# EAGLE design PAM2401_Module (EAGLE 9.6.2)
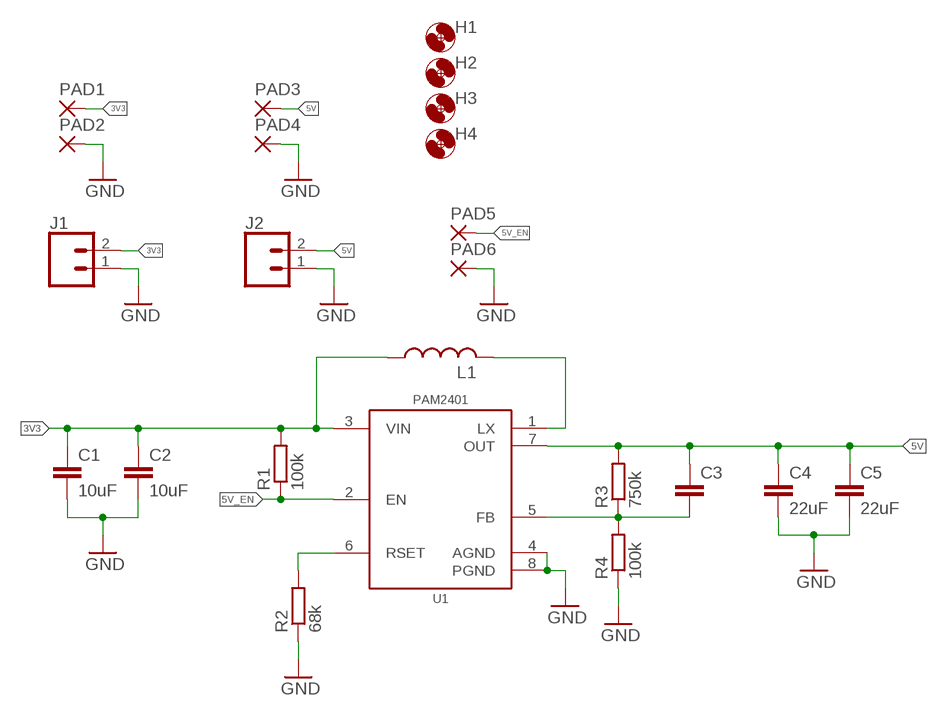
[diagram p0: schematic, sheet 1]

## Parts
C1  10uF  C-EU10UFC0805  [C0805]
C2  10uF  C-EU10UFC0805  [C0805]
C3  C-EUC0603  [C0603]
C4  22uF  C-EU22UFC0805  [C0805]
C5  22uF  C-EU22UFC0805  [C0805]
H1  MOUNTING_HOLE2_NP  [2_56]
H2  MOUNTING_HOLE2_NP  [2_56]
H3  MOUNTING_HOLE2_NP  [2_56]
H4  MOUNTING_HOLE2_NP  [2_56]
J1  CONN_023.5MM_ROUND_RESTRICT  [SCREWTERMINAL-3.5MM-2_ROUND_RESTRICT]
J2  CONN_023.5MM_ROUND_RESTRICT  [SCREWTERMINAL-3.5MM-2_ROUND_RESTRICT]
L1  INDUCTOR_MAPI_2.5X2  [WE-MAPI(2.5X2)]
PAD1  SMD5  [SMD2,54-5,08]
PAD2  SMD5  [SMD2,54-5,08]
PAD3  SMD5  [SMD2,54-5,08]
PAD4  SMD5  [SMD2,54-5,08]
PAD5  SMD2  [SMD1,27-2,54]
PAD6  SMD2  [SMD1,27-2,54]
R1  100k  R-EU_100KR0603  [R0603]
R2  68k  R-EU_R0603  [R0603]
R3  750k  R-EU_750KR0603  [R0603]
R4  100k  R-EU_100KR0603  [R0603]
U1  PAM2401MSOP  [MSOP_8]

## Nets
3V3: C1.1 C2.1 J1.2 L1.P$1 PAD1.1(P) R1.2 U1.3(VIN)
5V: C3.1 C4.1 C5.1 J2.2 PAD3.1(P) R3.2 U1.7(OUT)
5V_EN: PAD5.1(P) R1.1 U1.2(EN)
GND: C1.2 C2.2 C4.2 C5.2 J1.1 J2.1 PAD2.1(P) PAD4.1(P) PAD6.1(P) R2.1 R4.1 U1.4(AGND) U1.8(PGND)
N$2: R2.2 U1.6(RSET)
N$3: C3.2 R3.1 R4.2 U1.5(FB)
N$18: L1.P$2 U1.1(LX)

## Library data of the parts
C1 C2 = bschulz_passives:C-EU: CAPACITOR, European symbol; DIGIKEY: 490-6473-1-ND; MF: Murata; MPN: GRM21BR61C106KE15K
C3 = bschulz_passives:C-EU: CAPACITOR, European symbol
C4 C5 = bschulz_passives:C-EU: CAPACITOR, European symbol; DIGIKEY: 490-9952-1-ND; MF: Murata; MPN: GRM219R61C226ME15L
H1-H4 = bschulz:MOUNTING_HOLE: Genaric Mechanical Mounting Hole Hole diameter based on max body diameter + 15% Keepout ring is for diameter of socket cap screw (minimum required clearance) TPlace ring is for diameter of pan head screw (recomended clearance) Specifications: Socket Cap <http://fastener-express.com/fastener-technical/SocketscapSS-Alloy.pdf> Button Head Socket Cap <http://fastener-express.com/fastener-technical/Button-Socket-alloy.pdf> Pan Head <http://fastener-express.com/fastener-technical/pan-machine-Screws.pdf>; DIGIKEY: DNP; MF: N/A; MPN: DNP
J1 J2 = bschulz:CONN_02: Genaric 2 terminal header SCREW_2.54 <https://www.digikey.com/product-detail/en/on-shore-technology-inc/OSTVN02A150/ED10561-ND/1588862> 39532_RA <https://www.digikey.com/product-detail/en/molex/0395321002/WM7845-ND/1280696>; DIGIKEY: ED2635-ND; MF: On Shore; MPN: OSTTE020161
L1 = bschulz:INDUCTOR: Genaric Inductor
PAD1-PAD4 = wirepad:SMD5: SMD PAD
PAD5 PAD6 = bschulz:SMD2: SMD PAD; DIGIKEY: N/A; MF: N/A; MPN: DNP
R1 R4 = bschulz_passives:R-EU_: RESISTOR, European symbol Digikey Parts: Yageo, 0402 <https://www.digikey.com/products/en/resistors/chip-resistor-surface-mount/52?k=&pkeyword=&sv=0&s=4356&sf=1&FV=-1%7C13%2C7%7C2%2C1291%7C39157%2C1989%7C0%2C-8%7C52%2C3%7C1131%2C3%7C2503&quantity=&ColumnSort=0&page=1&stock=1&pageSize=25> Yageo, 0603 <https://www.digikey.com/products/en/resistors/chip-resistor-surface-mount/52?k=&pkeyword=&sv=0&pv1291=39245&sf=1&FV=-5%7C4356%2C-5%7C47360%2C-8%7C52%2C-1%7C13%2C7%7C2%2C1989%7C0&quantity=10&ColumnSort=1000011&page=1&stock=1&pageSize=25> Panasonic, 0603 <https://www.digikey.com/products/en/resistors/chip-resistor-surface-mount/52?k=&pkeyword=&pv252=68&sf=0&FV=ffec373d%2C1c0002%2C142c040c%2C1f140000%2Cffe00034%2C80002%2Cc0001&quantity=&ColumnSort=0&page=1&stock=1&pageSize=25> Panasonic, precision, 0603 <https://www.digikey.com/products/en/resistors/chip-resistor-surface-mount/52?FV=ffec4907%2Cfffc000a%2Cc0172%2C142c040c%2C1f140000%2Cffe00034%2C1c0002&quantity=100&ColumnSort=2085&page=1&stock=1&pageSize=25> Panasonic, 0805 <https://www.digikey.com/products/en/resistors/chip-resistor-surface-mount/52?k=&pkeyword=&pv3=1&sf=0&FV=ffec373d%2C1c0002%2C1f140000%2Cffe00034%2C142c040d&quantity=&ColumnSort=0&page=1&stock=1&pageSize=25> Rohm, current sense <https://www.digikey.com/products/en/resistors/chip-resistor-surface-mount/52?k=&pkeyword=&pv3=1&sf=0&FV=ffecb688%2C1f140000%2Cffe00034%2C1c0002&quantity=&ColumnSort=0&page=1&stock=1&pageSize=25> Vishay, pulse proof automotive <https://www.digikey.com/products/en/resistors/chip-resistor-surface-mount/52?k=&pkeyword=&pv7=2&sf=0&FV=ffec5d6b%2Cffe00034%2C1f140000&quantity=&ColumnSort=0&page=1&stock=1&pageSize=25>; DIGIKEY: 311-100KHRCT-ND; MF: Yageo; MPN: RC0603FR-07100KL; VALUE_PART: 100k
R2 = bschulz_passives:R-EU_: RESISTOR, European symbol Digikey Parts: Yageo, 0402 <https://www.digikey.com/products/en/resistors/chip-resistor-surface-mount/52?k=&pkeyword=&sv=0&s=4356&sf=1&FV=-1%7C13%2C7%7C2%2C1291%7C39157%2C1989%7C0%2C-8%7C52%2C3%7C1131%2C3%7C2503&quantity=&ColumnSort=0&page=1&stock=1&pageSize=25> Yageo, 0603 <https://www.digikey.com/products/en/resistors/chip-resistor-surface-mount/52?k=&pkeyword=&sv=0&pv1291=39245&sf=1&FV=-5%7C4356%2C-5%7C47360%2C-8%7C52%2C-1%7C13%2C7%7C2%2C1989%7C0&quantity=10&ColumnSort=1000011&page=1&stock=1&pageSize=25> Panasonic, 0603 <https://www.digikey.com/products/en/resistors/chip-resistor-surface-mount/52?k=&pkeyword=&pv252=68&sf=0&FV=ffec373d%2C1c0002%2C142c040c%2C1f140000%2Cffe00034%2C80002%2Cc0001&quantity=&ColumnSort=0&page=1&stock=1&pageSize=25> Panasonic, precision, 0603 <https://www.digikey.com/products/en/resistors/chip-resistor-surface-mount/52?FV=ffec4907%2Cfffc000a%2Cc0172%2C142c040c%2C1f140000%2Cffe00034%2C1c0002&quantity=100&ColumnSort=2085&page=1&stock=1&pageSize=25> Panasonic, 0805 <https://www.digikey.com/products/en/resistors/chip-resistor-surface-mount/52?k=&pkeyword=&pv3=1&sf=0&FV=ffec373d%2C1c0002%2C1f140000%2Cffe00034%2C142c040d&quantity=&ColumnSort=0&page=1&stock=1&pageSize=25> Rohm, current sense <https://www.digikey.com/products/en/resistors/chip-resistor-surface-mount/52?k=&pkeyword=&pv3=1&sf=0&FV=ffecb688%2C1f140000%2Cffe00034%2C1c0002&quantity=&ColumnSort=0&page=1&stock=1&pageSize=25> Vishay, pulse proof automotive <https://www.digikey.com/products/en/resistors/chip-resistor-surface-mount/52?k=&pkeyword=&pv7=2&sf=0&FV=ffec5d6b%2Cffe00034%2C1f140000&quantity=&ColumnSort=0&page=1&stock=1&pageSize=25>; MF: Yageo
R3 = bschulz_passives:R-EU_: RESISTOR, European symbol Digikey Parts: Yageo, 0402 <https://www.digikey.com/products/en/resistors/chip-resistor-surface-mount/52?k=&pkeyword=&sv=0&s=4356&sf=1&FV=-1%7C13%2C7%7C2%2C1291%7C39157%2C1989%7C0%2C-8%7C52%2C3%7C1131%2C3%7C2503&quantity=&ColumnSort=0&page=1&stock=1&pageSize=25> Yageo, 0603 <https://www.digikey.com/products/en/resistors/chip-resistor-surface-mount/52?k=&pkeyword=&sv=0&pv1291=39245&sf=1&FV=-5%7C4356%2C-5%7C47360%2C-8%7C52%2C-1%7C13%2C7%7C2%2C1989%7C0&quantity=10&ColumnSort=1000011&page=1&stock=1&pageSize=25> Panasonic, 0603 <https://www.digikey.com/products/en/resistors/chip-resistor-surface-mount/52?k=&pkeyword=&pv252=68&sf=0&FV=ffec373d%2C1c0002%2C142c040c%2C1f140000%2Cffe00034%2C80002%2Cc0001&quantity=&ColumnSort=0&page=1&stock=1&pageSize=25> Panasonic, precision, 0603 <https://www.digikey.com/products/en/resistors/chip-resistor-surface-mount/52?FV=ffec4907%2Cfffc000a%2Cc0172%2C142c040c%2C1f140000%2Cffe00034%2C1c0002&quantity=100&ColumnSort=2085&page=1&stock=1&pageSize=25> Panasonic, 0805 <https://www.digikey.com/products/en/resistors/chip-resistor-surface-mount/52?k=&pkeyword=&pv3=1&sf=0&FV=ffec373d%2C1c0002%2C1f140000%2Cffe00034%2C142c040d&quantity=&ColumnSort=0&page=1&stock=1&pageSize=25> Rohm, current sense <https://www.digikey.com/products/en/resistors/chip-resistor-surface-mount/52?k=&pkeyword=&pv3=1&sf=0&FV=ffecb688%2C1f140000%2Cffe00034%2C1c0002&quantity=&ColumnSort=0&page=1&stock=1&pageSize=25> Vishay, pulse proof automotive <https://www.digikey.com/products/en/resistors/chip-resistor-surface-mount/52?k=&pkeyword=&pv7=2&sf=0&FV=ffec5d6b%2Cffe00034%2C1f140000&quantity=&ColumnSort=0&page=1&stock=1&pageSize=25>; DIGIKEY: 311-750KHRCT-ND; MF: Yageo; MPN: RC0603FR-07750KL; VALUE_PART: 750k
U1 = bschulz:PAM2401: PAM2401 - Step-Up (Boost) DC-DC Converter Characteristics: Vin: 0.9V ~ 4.75V Vout: 2.5V ~ 5V Iout: 1A IQ: 150μA Operating Temperature: -40°C to 85°C Digikey: PAM2401SCADJDICT-ND <https://www.digikey.com/en/products/detail/diodes-incorporated/PAM2401SCADJ/4898817>; DIGIKEY: PAM2401SCADJDICT-ND; MF: Diodes Inc; MPN: PAM2401SCADJ

## Board
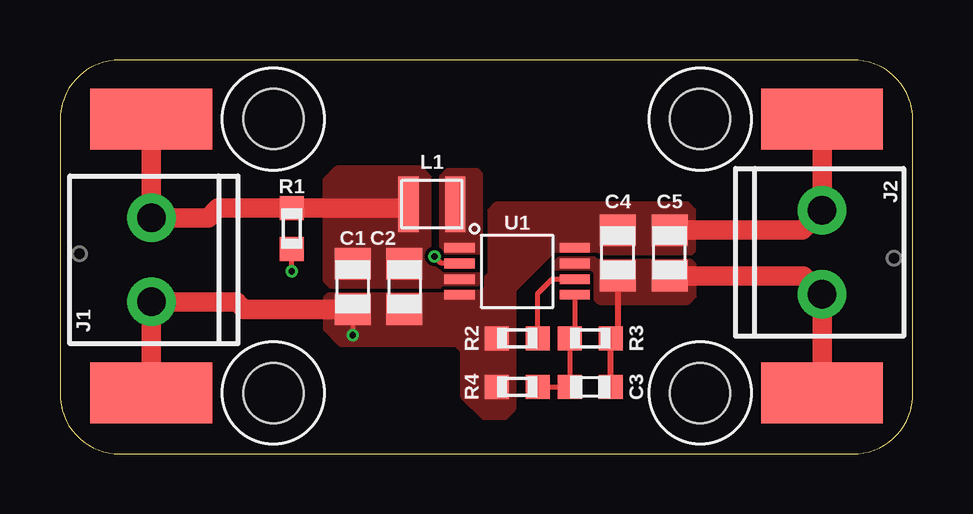
[diagram p1: board, top side]
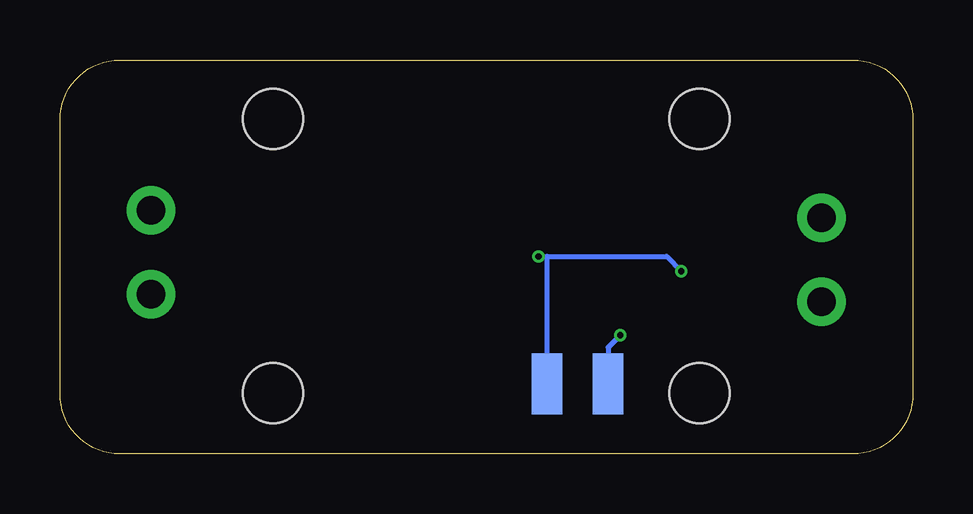
[diagram p2: board, bottom side, seen from below]

Size 35.54 x 16.43 mm. Coordinates in mm from the lower left corner, seen from the top.
Outline: 33.04,16.43 2.5,16.43 arc90 0,13.93 0,2.5 arc90 2.5,0 33.04,0 arc90 35.54,2.5 35.54,13.93 arc90 33.04,16.43
Copper layers (1*16): Top 0.035559375mm / dielectric 1.6mm / Bottom 0.035559375mm
Design rules "oshpark-2layer": minimum track width 6mil, minimum drill 10mil, track to track 6mil, track to pad 6mil, pad to pad 6mil, via to via 6mil, smd to smd 6mil, copper to edge 15mil, drill to drill 6mil, minimum pad ring 5mil, minimum via ring 5mil, stop-mask expansion 2.5mil, vias tented up to drill 0mil, thermal gap 10mil

### Footprints (pad centres in the part's own frame; a part is rotated, then mirrored left to right if it is on the bottom)
C0805 = smd 1.3 x 1.5: 1 -0.95,0; 2 0.95,0
C0603 = smd 1 x 1: 1 -0.85,0; 2 0.85,0
2_56 = hole 2.5: 0,0
SCREWTERMINAL-3.5MM-2_ROUND_RESTRICT = drill 1.2 pad 2.032: 1 0,0; 2 3.5,0
WE-MAPI(2.5X2) = smd 0.85 x 2.3: P$1 -0.975,0; P$2 0.975,0
SMD2,54-5,08 = smd 2.54 x 5.08: 1 0,0
SMD1,27-2,54 = smd 1.27 x 2.54: 1 0,0
R0603 = smd 1 x 1: 1 -0.85,0; 2 0.85,0
MSOP_8 = smd 1.26 x 0.4: 1 -2.4,0.975; 2 -2.4,0.325; 3 -2.4,-0.325; 4 -2.4,-0.975; 5 2.4,-0.975; 6 2.4,-0.325; 7 2.4,0.325; 8 2.4,0.975

### Placement (x,y rotation side)
C1  12.19,6.99 270 top
C2  14.35,6.99 270 top
C3  22.1,2.79 180 top
C4  23.24,8.38 90 top
C5  25.4,8.38 90 top
H1  8.89,2.54 0 top
H2  8.89,13.97 0 top
H3  26.67,2.54 0 top
H4  26.67,13.97 0 top
J1  3.81,6.35 90 top
J2  31.75,10.16 270 top
L1  15.49,10.41 0 top
PAD1  3.81,13.97 90 top
PAD2  3.81,2.54 90 top
PAD3  31.75,2.54 90 top
PAD4  31.75,13.97 90 top
PAD5  15.24,2.92 0 bottom
PAD6  12.7,2.92 0 bottom
R1  9.65,9.4 90 top
R2  19.05,4.83 0 top
R3  22.1,4.83 0 top
R4  19.05,2.79 0 top
U1  19.05,7.62 0 top

### Tracks (layer width: path | path; a pad name or v marks a point on that pad's centre or on a via)
3V3
  Top 0.61: 14.35,10.25 L1.P$1
  Top 0.813: 14.35,10.25 R1.2 6.57,10.25 6.17,9.85 J1.2 PAD1.1
  pour Top (rank 2, no thermals): 14.99,11.94 15.37,11.56 15.37,8 15.75,7.62 17.27,7.62 17.4,7.49 17.4,7.11 17.27,6.99 11.3,6.99 11.05,7.24 11.05,11.43 11.56,11.94
5V
  Top 0.254: C3.1 R3.2 23.24,5.12 C4.1
  Top 0.813: PAD3.1 J2.2 30.98,7.43 C5.1
  pour Top (no thermals): 26.29,8 22.35,8 22.23,8.13 20.83,8.13 20.7,8 20.7,7.75 20.83,7.62 21.97,7.62 22.23,7.37 22.23,6.6 22.48,6.35 26.16,6.35 26.42,6.6 26.42,7.87
5V_EN  (via drill 0.25)
  Top 0.2: U1.2 15.89,7.95 v15.6,8.24 | v9.65,7.62 R1.1
  Bottom 0.2: v15.6,8.24 15.24,8.24 | 15.24,8.24 10.27,8.24 v9.65,7.62 | PAD5.1 15.24,8.24
GND  (via drill 0.25)
  Top 0.2: C1.2 v12.19,4.95
  Top 0.813: PAD2.1 J1.1 7.37,6.35 7.68,6.04 C1.2 | C5.2 30.92,9.33 J2.1 PAD4.1
  Bottom 0.2: v12.19,4.95 12.7,4.45 PAD6.1
  pour Top (rank 3, no thermals): 17.27,6.86 16.13,6.86 16,6.73 11.3,6.73 11.05,6.48 11.05,5.21 11.68,4.57 16.51,4.57 16.76,4.32 16.76,2.41 17.65,1.52 18.54,1.52 18.92,1.91 18.92,6.86 20.45,8.38 26.29,8.38 26.42,8.51 26.42,10.16 26.16,10.41 18.16,10.41 17.91,10.16 17.91,7.49
N$2
  Top 0.2: R2.2 19.9,6.69 20.5,7.29 U1.6
N$3
  Top 0.2: U1.5 21.45,5.03 R3.1 C3.2 R4.2
N$18
  pour Top (no thermals): 15.88,11.56 15.88,8.51 16,8.38 17.4,8.38 17.53,8.51 17.53,11.68 17.4,11.81 16.13,11.81

### Text on the board
tDocu: Vin | Tosche | Vout | + | - | + | - | PAM2401 / v0.0 / B. Schulz
bDocu: GND | EN